# Altium schematic sheet AP2-Core.SchDoc
size B; SheetNumber: 0; SheetTotal: 0
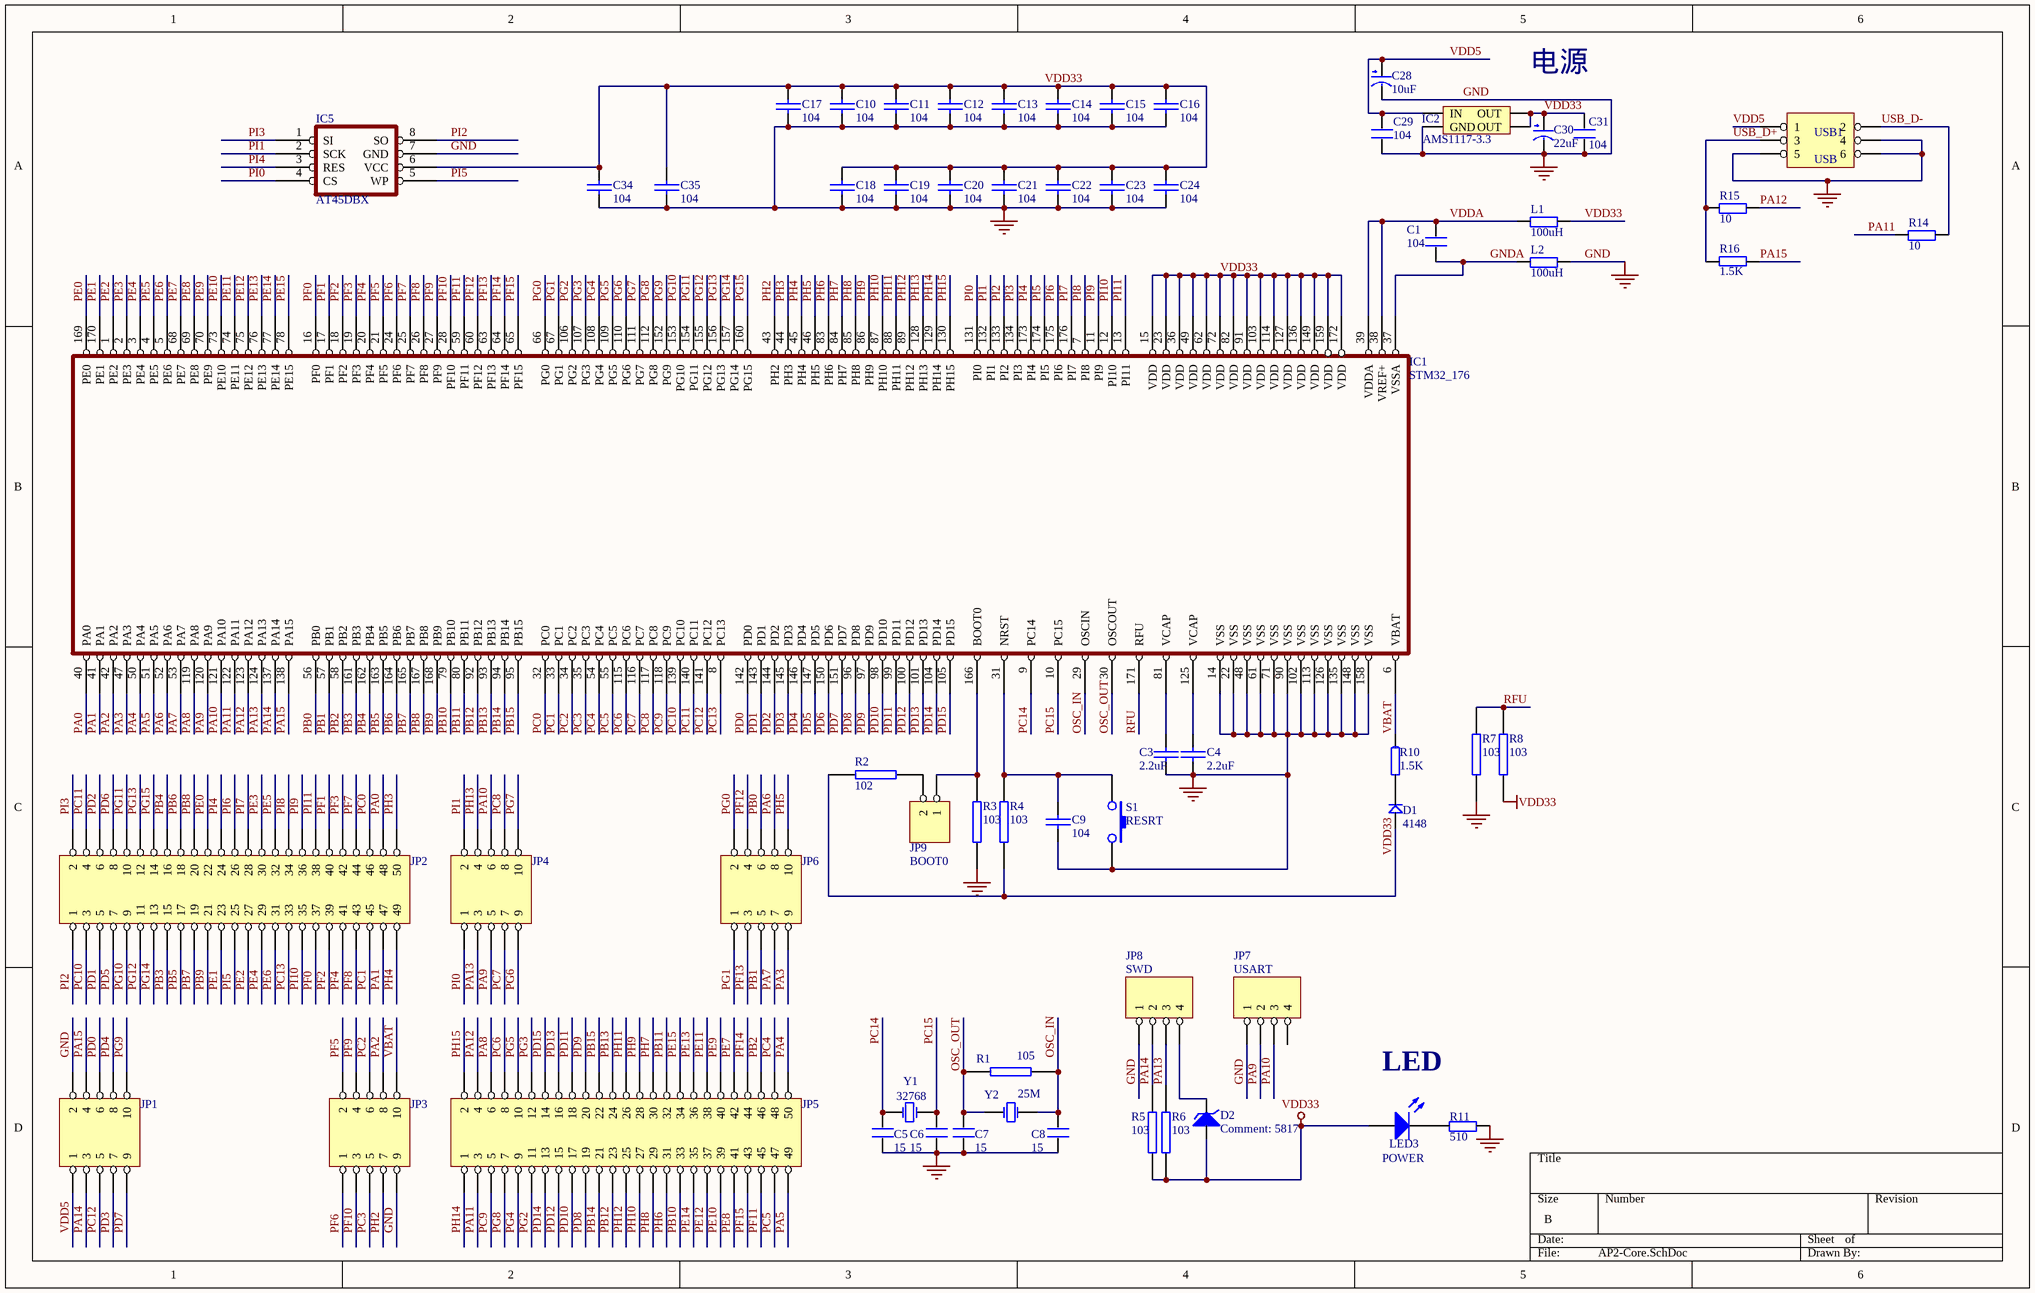
[diagram p0: AP2-Core.SchDoc]

## Parts
C1  104  [0603P]
C3  2.2uF  [3528]
C4  2.2uF  [3528]
C5  15  [0603P]
C6  15  [0603P]
C7  15  [0603P]
C8  15  [0603P]
C9  104  [0603P]
C10  104  [0603P]
C11  104  [0603P]
C12  104  [0603P]
C13  104  [0603P]
C14  104  [0603P]
C15  104  [0603P]
C16  104  [0603P]
C17  104  [0603P]
C18  104  [0603P]
C19  104  [0603P]
C20  104  [0603P]
C21  104  [0603P]
C22  104  [0603P]
C23  104  [0603P]
C24  104  [0603P]
C28  10uF  [1206C]
C29  104  [0603P]
C30  22uF  [3528]
C31  104  [0603P]
C34  104  [0603P]
C35  104  [0603P]
D1  4148  [DIODE_SOP]
D2  5817  [T5817]
IC1  STM32_176  [LQFP176]
IC2  AMS1117-3.3  [AMS1117]
IC5  AT45DBX  [SOIC-8]
JP1  (no value)
JP2  (no value)
JP3  (no value)
JP4  (no value)
JP5  (no value)
JP6  (no value)
JP7  USART  [SIP3]
JP8  SWD  [SIP4]
JP9  BOOT0
L1  100uH  [0805]
L2  100uH  [0805]
LED3  POWER  [0603P]
R1  105  [0603P]
R2  102  [0603P]
R3  103  [0603P]
R4  103  [0603P]
R5  103  [0603p]
R6  103  [0603P]
R7  103  [0603P]
R8  103  [0603P]
R10  1.5K  [0603P]
R11  510  [0603P]
R14  10  [0603P]
R15  10  [0603P]
R16  1.5K  [0603P]
S1  RESRT
USB1  USB  [MINI USB D]
Y1  32768  [MC-146]
Y2  25M  [XTALV-49USMD]

## Nets
GND: C3.2 C4.2 C5.1 C6.1 C7.2 C8.2 C9.2 C10.2 C11.2 C12.2 C13.2 C14.2 C15.2 C16.2 C17.2 C18.2 C19.2 C20.2 C21.2 C22.2 C23.2 C24.2 C28.2(GND) C29.1 C30.2(GND) C31.1 C34.2 C35.2 IC1.14(VSS) IC1.22(VSS) IC1.48(VSS) IC1.61(VSS) IC1.71(VSS) IC1.90(VSS) IC1.102(VSS) IC1.113(VSS) IC1.126(VSS) IC1.135(VSS) IC1.148(VSS) IC1.158(VSS) IC2.1(GND) IC5.7(GND) JP1.2 JP3.9 JP7.1 JP8.1 L2.2 R3.1 R7.1 R11.2 S1.2 USB1.4 USB1.5 USB1.6
VDD33: C10.1 C11.1 C12.1 C13.1 C14.1 C15.1 C16.1 C17.1 C18.1 C19.1 C20.1 C21.1 C22.1 C23.1 C24.1 C30.1(VCC) C31.2 C34.1 C35.1 D1.1 D2.A IC1.15(VDD) IC1.23(VDD) IC1.36(VDD) IC1.49(VDD) IC1.62(VDD) IC1.72(VDD) IC1.82(VDD) IC1.91(VDD) IC1.103(VDD) IC1.114(VDD) IC1.127(VDD) IC1.136(VDD) IC1.149(VDD) IC1.159(VDD) IC1.172(VDD) IC2.2(OUT) IC2.4(OUT) IC5.6(VCC) L1.2 LED3.1(A) R2.2 R4.1 R5.1 R6.1 R8.1
GNDA: C1.1 IC1.37(VSSA) L2.1
OSC_IN: C8.1 IC1.29(OSCIN) R1.2 Y2.1(OSC1)
OSC_OUT: C7.1 IC1.30(OSCOUT) R1.1 Y2.2(OSC2)
PA0: IC1.40(PA0) JP2.48
PA1: IC1.41(PA1) JP2.47
PA2: IC1.42(PA2) JP3.8
PA3: IC1.47(PA3) JP6.9
PA4: IC1.50(PA4) JP5.50
PA5: IC1.51(PA5) JP5.49
PA6: IC1.52(PA6) JP6.8
PA7: IC1.53(PA7) JP6.7
PA8: IC1.119(PA8) JP5.6
PA9: IC1.120(PA9) JP4.5 JP7.2
PA10: IC1.121(PA10) JP4.6 JP7.3
PA11: IC1.122(PA11) JP5.3 R14.1
PA12: IC1.123(PA12) JP5.4 R15.2
PA13: IC1.124(PA13) JP4.3 JP8.3 R6.2
PA14: IC1.137(PA14) JP1.3 JP8.2 R5.2
PA15: IC1.138(PA15) JP1.4 R16.1
PB0: IC1.56(PB0) JP6.6
PB1: IC1.57(PB1) JP6.5
PB2: IC1.58(PB2) JP5.46
PB3: IC1.161(PB3) JP2.15
PB4: IC1.162(PB4) JP2.16
PB5: IC1.163(PB5) JP2.17
PB6: IC1.164(PB6) JP2.18
PB7: IC1.165(PB7) JP2.19
PB8: IC1.167(PB8) JP2.20
PB9: IC1.168(PB9) JP2.21
PB10: IC1.79(PB10) JP5.33
PB11: IC1.80(PB11) JP5.32
PB12: IC1.92(PB12) JP5.23
PB13: IC1.93(PB13) JP5.24
PB14: IC1.94(PB14) JP5.21
PB15: IC1.95(PB15) JP5.22
PC0: IC1.32(PC0) JP2.46
PC1: IC1.33(PC1) JP2.45
PC2: IC1.34(PC2) JP3.6
PC3: IC1.35(PC3) JP3.5
PC4: IC1.54(PC4) JP5.48
PC5: IC1.55(PC5) JP5.47
PC6: IC1.115(PC6) JP5.8
PC7: IC1.116(PC7) JP4.7
PC8: IC1.117(PC8) JP4.8
PC9: IC1.118(PC9) JP5.5
PC10: IC1.139(PC10) JP2.3
PC11: IC1.140(PC11) JP2.4
PC12: IC1.141(PC12) JP1.5
PC13: IC1.8(PC13) JP2.33
PC14: C5.2 IC1.9(PC14) Y1.1(OSC1)
PC15: C6.2 IC1.10(PC15) Y1.2(OSC2)
PD0: IC1.142(PD0) JP1.6
PD1: IC1.143(PD1) JP2.5
PD2: IC1.144(PD2) JP2.6
PD3: IC1.145(PD3) JP1.7
PD4: IC1.146(PD4) JP1.8
PD5: IC1.147(PD5) JP2.7
PD6: IC1.150(PD6) JP2.8
PD7: IC1.151(PD7) JP1.9
PD8: IC1.96(PD8) JP5.19
PD9: IC1.97(PD9) JP5.20
PD10: IC1.98(PD10) JP5.17
PD11: IC1.99(PD11) JP5.18
PD12: IC1.100(PD12) JP5.15
PD13: IC1.101(PD13) JP5.16
PD14: IC1.104(PD14) JP5.13
PD15: IC1.105(PD15) JP5.14
PE0: IC1.169(PE0) JP2.22
PE1: IC1.170(PE1) JP2.23
PE2: IC1.1(PE2) JP2.27
PE3: IC1.2(PE3) JP2.30
PE4: IC1.3(PE4) JP2.29
PE5: IC1.4(PE5) JP2.32
PE6: IC1.5(PE6) JP2.31
PE7: IC1.68(PE7) JP5.42
PE8: IC1.69(PE8) JP5.41
PE9: IC1.70(PE9) JP5.40
PE10: IC1.73(PE10) JP5.39
PE11: IC1.74(PE11) JP5.38
PE12: IC1.75(PE12) JP5.37
PE13: IC1.76(PE13) JP5.36
PE14: IC1.77(PE14) JP5.35
PE15: IC1.78(PE15) JP5.34
PF0: IC1.16(PF0) JP2.37
PF1: IC1.17(PF1) JP2.40
PF2: IC1.18(PF2) JP2.39
PF3: IC1.19(PF3) JP2.42
PF4: IC1.20(PF4) JP2.41
PF5: IC1.21(PF5) JP3.2
PF6: IC1.24(PF6) JP3.1
PF7: IC1.25(PF7) JP2.44
PF8: IC1.26(PF8) JP2.43
PF9: IC1.27(PF9) JP3.4
PF10: IC1.28(PF10) JP3.3
PF11: IC1.59(PF11) JP5.45
PF12: IC1.60(PF12) JP6.4
PF13: IC1.63(PF13) JP6.3
PF14: IC1.64(PF14) JP5.44
PF15: IC1.65(PF15) JP5.43
PG0: IC1.66(PG0) JP6.2
PG1: IC1.67(PG1) JP6.1
PG2: IC1.106(PG2) JP5.11
PG3: IC1.107(PG3) JP5.12
PG4: IC1.108(PG4) JP5.9
PG5: IC1.109(PG5) JP5.10
PG6: IC1.110(PG6) JP4.9
PG7: IC1.111(PG7) JP4.10
PG8: IC1.112(PG8) JP5.7
PG9: IC1.152(PG9) JP1.10
PG10: IC1.153(PG10) JP2.9
PG11: IC1.154(PG11) JP2.10
PG12: IC1.155(PG12) JP2.11
PG13: IC1.156(PG13) JP2.12
PG14: IC1.157(PG14) JP2.13
PG15: IC1.160(PG15) JP2.14
PH2: IC1.43(PH2) JP3.7
PH3: IC1.44(PH3) JP2.50
PH4: IC1.45(PH4) JP2.49
PH5: IC1.46(PH5) JP6.10
PH6: IC1.83(PH6) JP5.31
PH7: IC1.84(PH7) JP5.30
PH8: IC1.85(PH8) JP5.29
PH9: IC1.86(PH9) JP5.28
PH10: IC1.87(PH10) JP5.27
PH11: IC1.88(PH11) JP5.26
PH12: IC1.89(PH12) JP5.25
PH13: IC1.128(PH13) JP4.4
PH14: IC1.129(PH14) JP5.1
PH15: IC1.130(PH15) JP5.2
PI0: IC1.131(PI0) IC5.4(CS) JP4.1
PI1: IC1.132(PI1) IC5.2(SCK) JP4.2
PI2: IC1.133(PI2) IC5.8(SO) JP2.1
PI3: IC1.134(PI3) IC5.1(SI) JP2.2
PI4: IC1.173(PI4) IC5.3(RES) JP2.24
PI5: IC1.174(PI5) IC5.5(WP) JP2.25
PI6: IC1.175(PI6) JP2.26
PI7: IC1.176(PI7) JP2.28
PI8: IC1.7(PI8) JP2.34
PI9: IC1.11(PI9) JP2.36
PI10: IC1.12(PI10) JP2.35
PI11: IC1.13(PI11) JP2.38
RFU: IC1.171(RFU) R7.2 R8.2
USB_D+: R15.1 R16.2 USB1.3
USB_D-: R14.2 USB1.2
VBAT: IC1.6(VBAT) JP3.10 R10.1
VDD5: C28.1(VCC) C29.2 IC2.3(IN) JP1.1 USB1.1
VDDA: C1.2 IC1.38(VREF+) IC1.39(VDDA) L1.1
NetC3_1: C3.1 IC1.81(VCAP)
NetC4_1: C4.1 IC1.125(VCAP)
NetC9_1: C9.1 IC1.31(NRST) R4.2 S1.1
NetD1_2: D1.2 R10.2
NetD2_K: D2.K JP8.4
NetIC1_166: IC1.166(BOOT0) JP9.1 R3.2
NetJP9_2: JP9.2 R2.1
NetLED3_2: LED3.2(K) R11.1

Not connected (* = marked no-connect by the designer): JP7 4

## Notes on the sheet
- 电源
- LED

## Library data of the parts
C1 C5-C8 C29 C31 = C
C3 C4 C9-C24 C34 C35 = CAP: Capacitor
C28 C30 = CAP
D1 = D: 1N4148
D2 = ZENER4: Zener Diode
IC2 = AMS1117
JP1 JP3 JP4 JP6 = HEADER 5X2
JP2 JP5 = HEADER 25X2
JP7 JP8 = 4 HEADER: 4 Pin Header
JP9 = HEADER 2
L1 L2 R10 R11 R14-R16 = R
LED3 = LED2: Typical RED, GREEN, YELLOW, AMBER GaAs LED; Published: *; LatestRevisionDate: *; LatestRevisionNote: *; PackageDocument: *; PackageReference: *; Publisher: *
R1-R8 = RES2
S1 = SW-PB
USB1 = HEADER 3X2
Y1 Y2 = XTAL: Crystal Oscillator; Published: *; LatestRevisionDate: *; LatestRevisionNote: *; Publisher: *